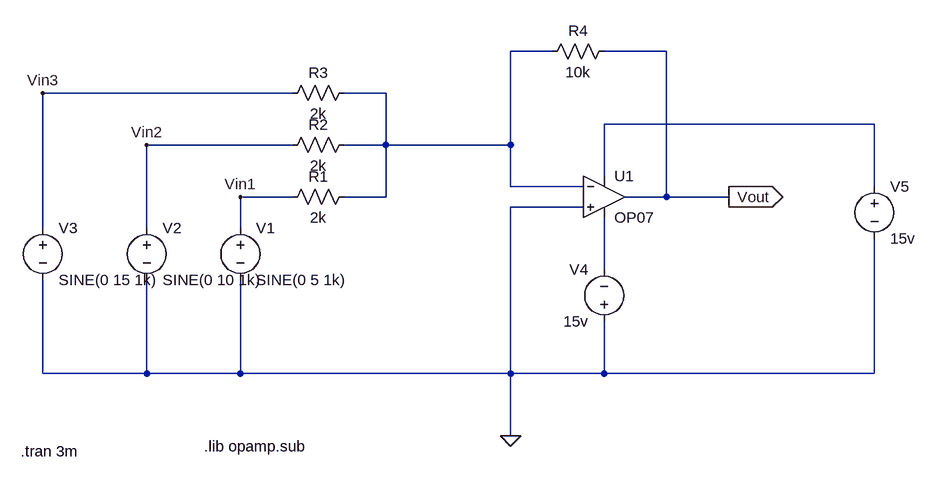
[diagram p0: schematic Summin Amplifier.asc]
Summin Amplifier.asc, the LTspice schematic file:
Version 4
SHEET 1 1176 680
WIRE 608 -128 544 -128
WIRE 784 -128 688 -128
WIRE 208 -64 -176 -64
WIRE 352 -64 288 -64
WIRE 1104 -16 688 -16
WIRE 208 16 -16 16
WIRE 352 16 352 -64
WIRE 352 16 288 16
WIRE 544 16 544 -128
WIRE 544 16 352 16
WIRE 688 64 688 -16
WIRE 544 80 544 16
WIRE 656 80 544 80
WIRE 1104 80 1104 -16
WIRE 208 96 128 96
WIRE 352 96 352 16
WIRE 352 96 288 96
WIRE 784 96 784 -128
WIRE 784 96 720 96
WIRE 880 96 784 96
WIRE 656 112 544 112
WIRE -176 144 -176 -64
WIRE -16 144 -16 16
WIRE 128 144 128 96
WIRE 688 208 688 128
WIRE -176 368 -176 224
WIRE -16 368 -16 224
WIRE -16 368 -176 368
WIRE 128 368 128 224
WIRE 128 368 -16 368
WIRE 544 368 544 112
WIRE 544 368 128 368
WIRE 688 368 688 288
WIRE 688 368 544 368
WIRE 1104 368 1104 160
WIRE 1104 368 688 368
WIRE 544 464 544 368
FLAG 544 464 0
FLAG 128 96 Vin1
FLAG -16 16 Vin2
FLAG -176 -64 Vin3
FLAG 880 96 Vout
IOPIN 880 96 Out
SYMBOL voltage 128 128 R0
WINDOW 123 0 0 Left 0
WINDOW 39 0 0 Left 0
SYMATTR InstName V1
SYMATTR Value SINE(0 5 1k)
SYMBOL voltage -16 128 R0
WINDOW 123 0 0 Left 0
WINDOW 39 0 0 Left 0
SYMATTR InstName V2
SYMATTR Value SINE(0 10 1k)
SYMBOL voltage -176 128 R0
WINDOW 123 0 0 Left 0
WINDOW 39 0 0 Left 0
SYMATTR InstName V3
SYMATTR Value SINE(0 15 1k)
SYMBOL res 304 80 R90
WINDOW 0 0 56 VBottom 2
WINDOW 3 32 56 VTop 2
SYMATTR InstName R1
SYMATTR Value 2k
SYMBOL res 304 0 R90
WINDOW 0 0 56 VBottom 2
WINDOW 3 32 56 VTop 2
SYMATTR InstName R2
SYMATTR Value 2k
SYMBOL res 304 -80 R90
WINDOW 0 0 56 VBottom 2
WINDOW 3 32 56 VTop 2
SYMATTR InstName R3
SYMATTR Value 2k
SYMBOL res 704 -144 R90
WINDOW 0 0 56 VBottom 2
WINDOW 3 32 56 VTop 2
SYMATTR InstName R4
SYMATTR Value 10k
SYMBOL OpAmps\\OP07 688 32 R0
SYMATTR InstName U1
SYMBOL voltage 688 304 R180
WINDOW 0 24 96 Left 2
WINDOW 3 24 16 Left 2
WINDOW 123 0 0 Left 0
WINDOW 39 0 0 Left 0
SYMATTR InstName V4
SYMATTR Value 15v
SYMBOL voltage 1104 64 R0
WINDOW 123 0 0 Left 0
WINDOW 39 0 0 Left 0
SYMATTR InstName V5
SYMATTR Value 15v
TEXT -210 488 Left 2 !.tran 3m
TEXT 72 480 Left 2 !.lib opamp.sub

The netlist it stands for:
* Summin Amplifier.asc
V1 Vin1 0 SINE(0 5 1k)
V2 Vin2 0 SINE(0 10 1k)
V3 Vin3 0 SINE(0 15 1k)
R1 N001 Vin1 2k
R2 N001 Vin2 2k
R3 N001 Vin3 2k
R4 Vout N001 10k
XU1 0 N001 N002 N003 Vout LT1001  ; OP07, pins In+ In- V+ V- OUT
V4 0 N003 15v
V5 N002 0 15v
.tran 3m
.lib opamp.sub
.lib LTC.lib
.backanno
.end